# EAGLE design Zio Qwiic Haptic Motor Controller DRV2605L (EAGLE 9.1.1)
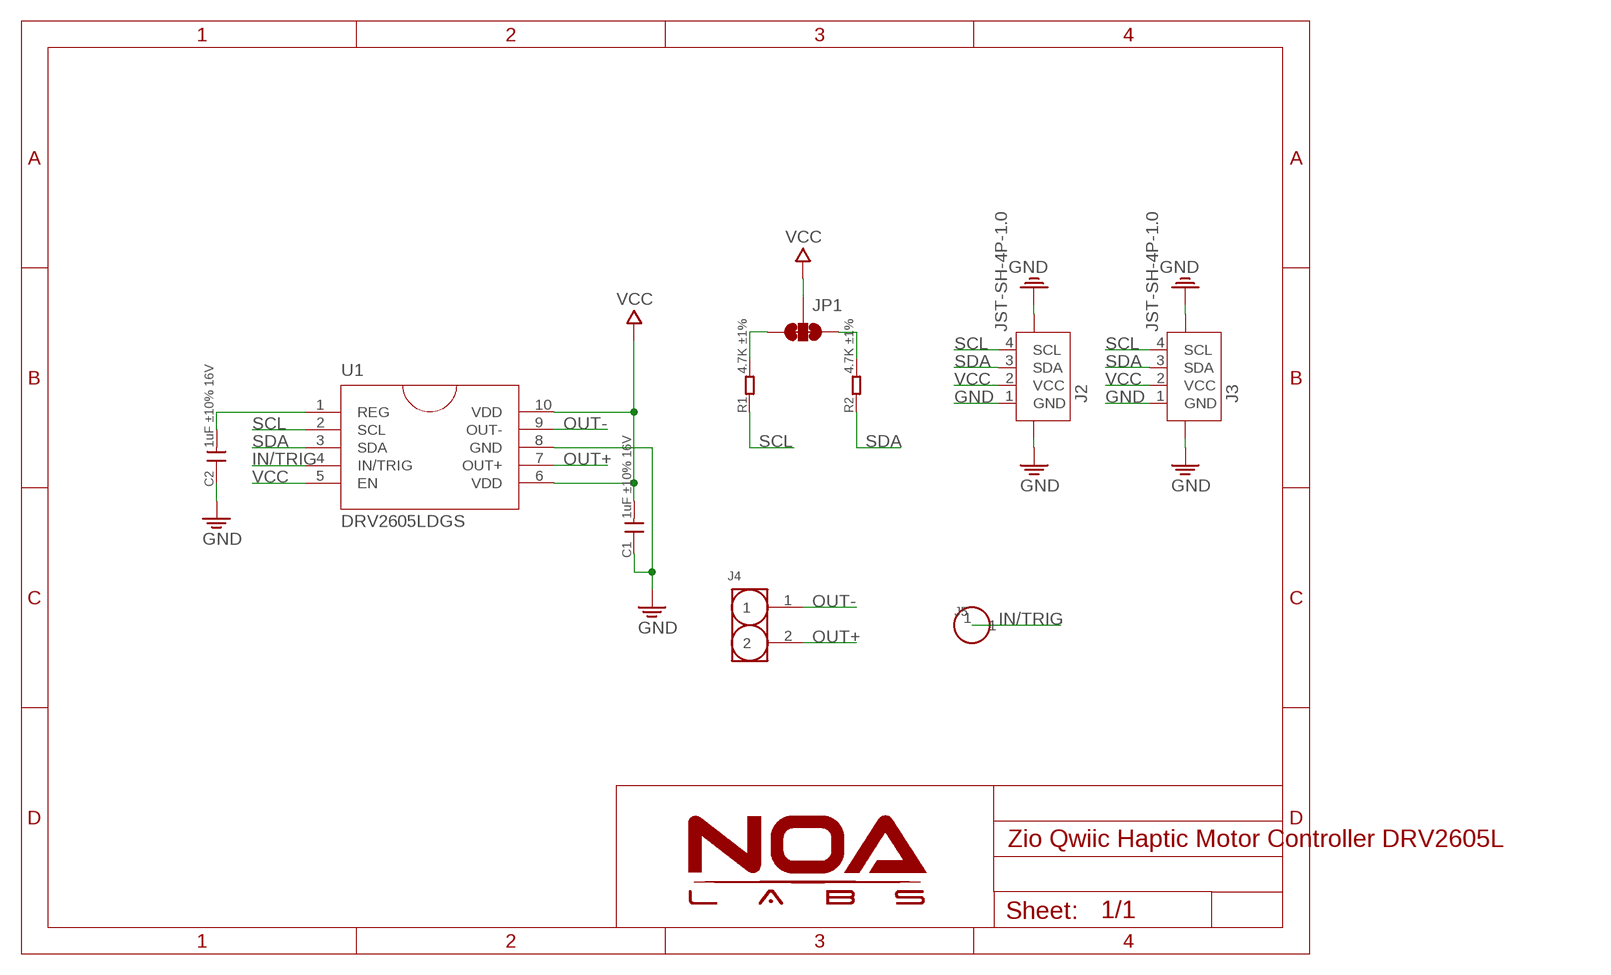
[diagram p0: schematic, sheet 1]

## Parts
C1  1uF ±10% 16V  C-0603  [C0603]
C2  1uF ±10% 16V  C-0603  [C0603]
J2  JST-SH-4P-1.0  [JST-SH-4P]
J3  JST-SH-4P-1.0  [JST-SH-4P]
J4  HEADER-2P-2.0  [2P-2.0]
J5  HEADER-1P  [1P-40MIL]
JP1  SMT-JUMPER_3_2-NC_TRACE  [SMT-JUMPER_3_2-NC_TRACE]
R1  4.7K ±1%  R-0402  [R0402]
R2  4.7K ±1%  R-0402  [R0402]
U1  DRV2605LDGS  DRV2605L  [VSSOP10]

## Nets
GND: C1.1 C2.1 J2.1(GND) J2.NC1 J2.NC2 J3.1(GND) J3.NC1 J3.NC2 U1.8(GND)
IN/TRIG: J5.1 U1.4(IN/TRIG)
N$3: C2.2 U1.1(REG)
N$6: JP1.3 R1.2
N$8: JP1.1 R2.2
OUT+: J4.2 U1.7(OUT+)
OUT-: J4.1 U1.9(OUT-)
SCL: J2.4(SCL) J3.4(SCL) R1.1 U1.2(SCL)
SDA: J2.3(SDA) J3.3(SDA) R2.1 U1.3(SDA)
VCC: C1.2 J2.2(VCC) J3.2(VCC) JP1.2 U1.5(EN) U1.6(VDD) U1.10(VDD)

## Library data of the parts
C1 C2 = RCL:C
J2 J3 = Connector:JST-SH-4P
J4 = Connector_NOA:HEADER-2P
J5 = Connector_NOA:HEADER-1P
JP1 = NOA-Jumpers:SMT-JUMPER_3_2-NC_TRACE
R1 R2 = RCL:R
U1 = IC:DRV2605L

## Board
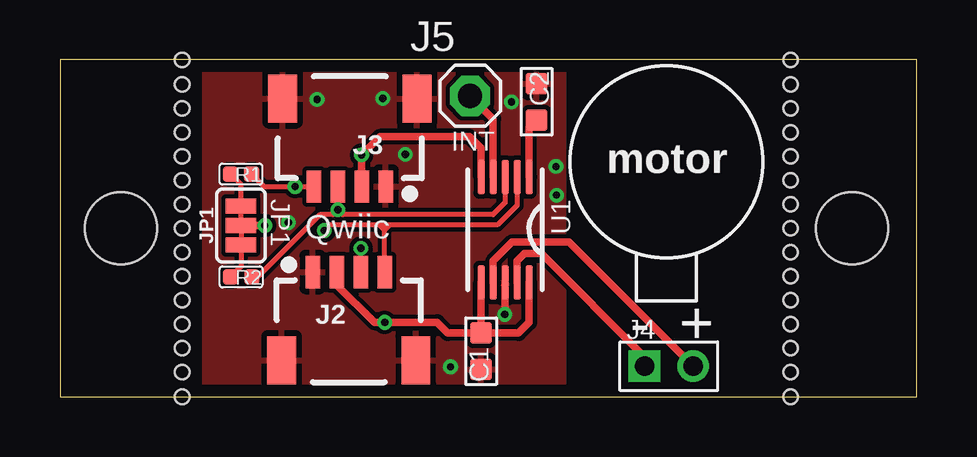
[diagram p1: board, top side]
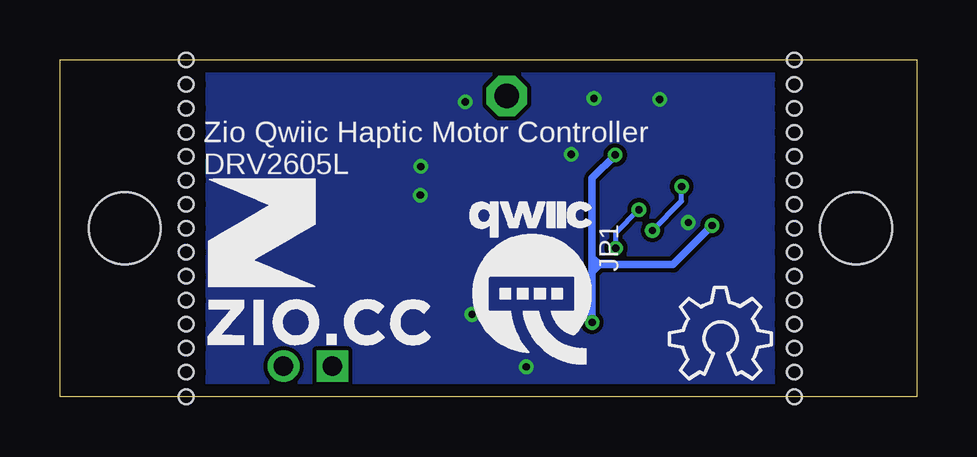
[diagram p2: board, bottom side, seen from below]

Size 35.72 x 14.05 mm. Coordinates in mm from the lower left corner, seen from the top.
Outline: 0,0 35.72,0 35.72,14.05 0,14.05 0,0
Copper layers (1*16): Top 0.035mm / dielectric 1.5mm / Bottom 0.035mm
Design rules "NOA Eagle Rule": minimum track width 7mil, minimum drill 12mil, track to track 7mil, track to pad 7mil, pad to pad 7mil, via to via 7mil, smd to smd 0mil, copper to edge 20mil, drill to drill 10mil, minimum pad ring 10mil, minimum via ring 6mil, stop-mask expansion 2mil, vias tented up to drill 25mil, thermal gap 10mil
Holes 3 mm at 2.54,7.02 33.02,7.02
Holes 0.6 mm at 5.1,7.02 5.1,8.02 5.1,9.02 5.1,10.02 5.1,11.02 5.1,12.02 5.1,13.02 5.1,14.05 5.1,6.02 5.1,5.02 5.1,4.02 5.1,3.02 5.1,2.02 5.1,1.02 5.1,0 30.46,7.02 30.46,8.02 30.46,9.02 30.46,10.02 30.46,11.02 30.46,12.02 30.46,13.02 30.46,14.05 30.46,6.02 30.46,5.02 30.46,4.02 30.46,3.02 30.46,2.02 30.46,1.02 30.46,0

### Footprints (pad centres in the part's own frame; a part is rotated, then mirrored left to right if it is on the bottom)
C0603 = smd 0.889 x 0.889: 1 -0.762,0; 2 0.762,0
JST-SH-4P = smd 0.6 x 1.35: 1 1.5,0; 2 0.5,0; 3 -0.5,0; 4 -1.5,0 | smd 1.2 x 2: NC1 -2.8,3.675; NC2 2.8,3.675
2P-2.0 = drill 0.813 pad 1.27 square: 1 -1.016,0 | drill 0.813 pad 1.27: 2 1.016,0
1P-40MIL = drill 1.016 pad 1.676 octagon: 1 0,0
SMT-JUMPER_3_2-NC_TRACE = smd 0.635 x 1.27: 1 -0.813,0; 2 0,0; 3 0.813,0
R0402 = smd 0.635 x 0.635: 1 -0.445,0; 2 0.445,0
VSSOP10 = smd 0.3 x 1.45: 1 -1,-2.2; 2 -0.5,-2.2; 3 0,-2.2; 4 0.5,-2.2; 5 1,-2.2; 6 1,2.2; 7 0.5,2.2; 8 0,2.2; 9 -0.5,2.2; 10 -1,2.2

### Placement (x,y rotation side)
C1  17.56,1.9 90 top
C2  19.87,12.3 270 top
J2  12.04,5.2 180 top
J3  12.08,8.77 0 top
J4  25.38,1.27 0 top
J5  17.09,12.55 0 top
JP1  7.54,7.14 90 top
R1  7.54,9.29 180 top
R2  7.55,5 180 top
U1  18.56,6.96 180 top
U$1  [7MM]  29.57,2.18 0 bottom
U$2  [OSHW_6X150_NOTEXT]  10.31,0.74 0 bottom
U$5  [QWIIC-LOGO-MEDIUM]  16.1,4.8 0 bottom

### Tracks (layer width: path | path; a pad name or v marks a point on that pad's centre or on a via)
GND  (via drill 0.3)
  Top 0.305: U1.8 18.56,3.43 v18.54,3.43
  other vias: 20.68,9.6 20.7,8.41 9.53,7.26 14.4,10.11 13.46,12.45 10.72,12.4 16.28,1.24 18.82,12.29
  pour Top: 6,14.05 21,14.05 21,0 6,0
  pour Bottom: 6,0 6,14.05 29.56,14.05 29.56,0
IN/TRIG
  Top 0.305: U1.4 18.06,11.59 J5.1
N$3
  Top 0.305: U1.1 19.56,11.22 C2.2
N$6
  Top 0.203: JP1.3 7.54,8.84 R1.2
N$8
  Top 0.203: JP1.1 7.54,5.43 R2.2
OUT+
  Top 0.305: U1.7 18.06,5.66 18.85,6.45 21.22,6.45 J4.2
OUT-
  Top 0.305: U1.9 19.06,5.67 19.36,5.97 20.07,5.97 24.37,1.67 J4.1
SCL  (via drill 0.3)
  Top 0.203: R1.1 8.51,8.77 v9.8,8.77 J3.4 | U1.2 19.06,7.98 18.24,7.16 15.14,7.16 13.74,7.16 | 13.74,7.16 13.31,7.16 | 13.31,7.16 11.25,7.16 v11.02,6.93 | J2.4 13.54,6.96 | 13.54,6.96 13.74,7.16 | 13.54,6.96 13.33,7.16 13.31,7.16
  Bottom 0.203: v11.02,6.93 9.8,8.15 v9.8,8.77
SDA  (via drill 0.3)
  Top 0.203: R2.1 8.25,5 10.85,7.59 11.38,7.59 | U1.3 18.56,8.09 18.06,7.59 11.79,7.59 | 11.79,7.59 11.38,7.59 | J3.3 v11.58,7.8 | v11.58,7.8 11.79,7.59 | v11.58,7.8 11.38,7.59 | J2.3 12.54,6.19 v12.55,6.2
  Bottom 0.203: v12.55,6.2 12.55,6.83 v11.58,7.8
VCC  (via drill 0.3)
  Top 0.305: J2.2 11.54,4.67 13.11,3.1 v13.54,3.1 15.72,3.1 16.16,2.66 C1.2 | C1.2 U1.6 | J3.2 12.58,10.07 v12.57,10.08 13.34,10.85 17.07,10.85 17.56,10.36 U1.5 | JP1.2 v8.53,7.14 | U1.10 19.56,3.1 19.12,2.66 C1.2
  Bottom 0.305: v13.54,3.1 13.54,5.21 | 13.54,5.21 13.54,5.82 | 13.54,5.82 13.54,9.12 v12.57,10.08 | v8.53,7.14 10.16,5.51 13.23,5.51 | 13.23,5.51 13.54,5.82 | 13.23,5.51 13.54,5.21

### Text on the board
tPlace: INT | motor | JP1 | Qwiic | - | +
bPlace: Zio Qwiic Haptic Motor Controller / DRV2605L | JP1